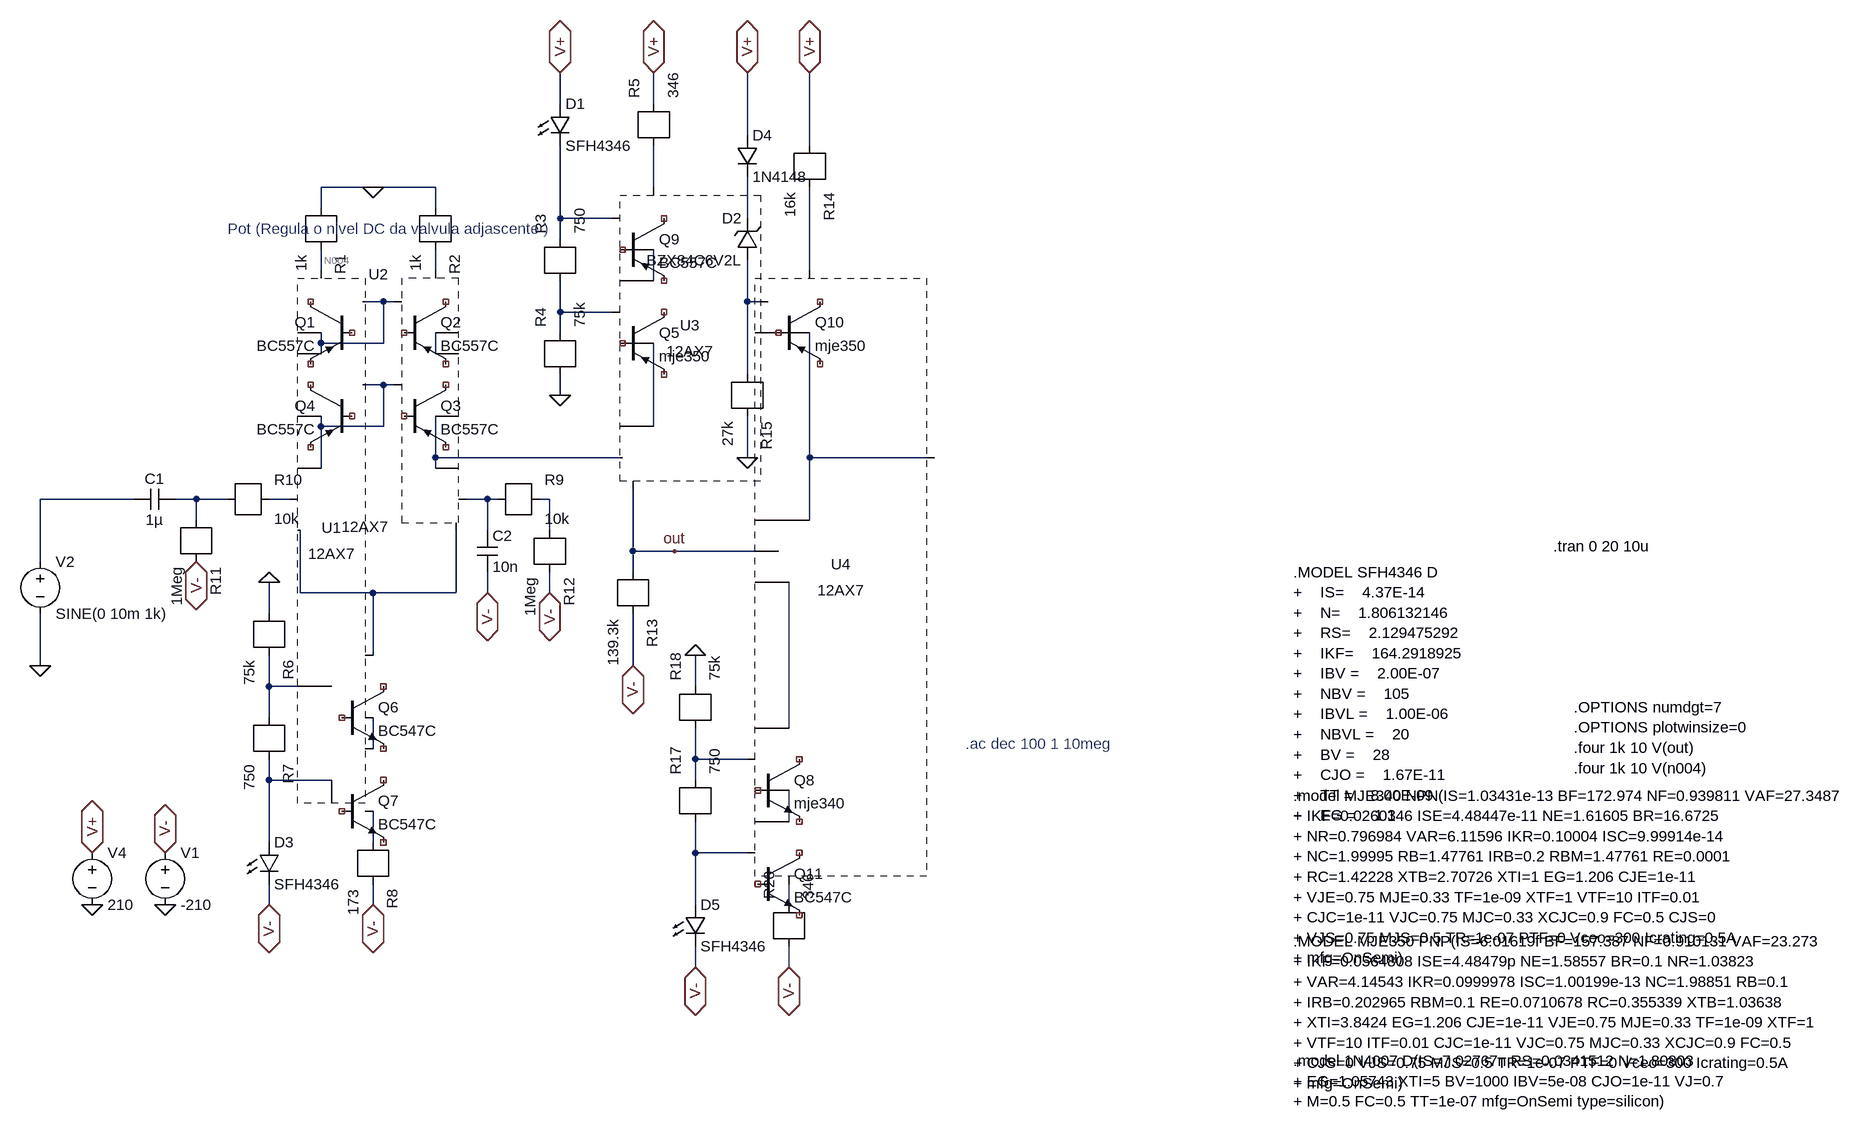
[diagram p0: schematic pre_TCC_active_loads.asc]
pre_TCC_active_loads.asc, the LTspice schematic file:
Version 4
SHEET 1 4724 1424
WIRE 640 -288 640 -336
WIRE 784 -288 784 -336
WIRE 928 -240 928 -336
WIRE 1024 -224 1024 -336
WIRE 352 -160 272 -160
WIRE 448 -160 352 -160
WIRE 784 -160 784 -224
WIRE 272 -128 272 -160
WIRE 448 -128 448 -160
WIRE 640 -112 640 -224
WIRE 720 -112 640 -112
WIRE 928 -112 928 -176
WIRE 640 -80 640 -112
WIRE 272 -32 272 -64
WIRE 448 -32 448 -64
WIRE 1024 -32 1024 -160
WIRE 784 -16 784 -64
WIRE 368 16 336 16
WIRE 384 16 368 16
WIRE 928 16 928 -48
WIRE 960 16 928 16
WIRE 640 32 640 -16
WIRE 720 32 640 32
WIRE 640 64 640 32
WIRE 272 80 272 64
WIRE 368 80 368 16
WIRE 368 80 272 80
WIRE 272 96 272 80
WIRE 448 96 448 64
WIRE 928 128 928 16
WIRE 368 144 336 144
WIRE 384 144 368 144
WIRE 640 160 640 128
WIRE 272 208 272 192
WIRE 368 208 368 144
WIRE 368 208 272 208
WIRE 784 208 784 80
WIRE 448 256 448 192
WIRE 736 256 448 256
WIRE 928 256 928 192
WIRE 1024 256 1024 64
WIRE 1216 256 1024 256
WIRE 272 272 272 208
WIRE 448 272 448 256
WIRE -16 320 -160 320
WIRE 80 320 48 320
WIRE 128 320 80 320
WIRE 224 320 192 320
WIRE 528 320 496 320
WIRE 544 320 528 320
WIRE 624 320 608 320
WIRE 80 352 80 320
WIRE 1024 352 1024 256
WIRE 528 368 528 320
WIRE 624 368 624 320
WIRE 752 400 752 304
WIRE 816 400 752 400
WIRE 976 400 816 400
WIRE -160 416 -160 320
WIRE 752 432 752 400
WIRE 240 464 240 368
WIRE 352 464 240 464
WIRE 480 464 480 368
WIRE 480 464 352 464
WIRE 528 464 528 432
WIRE 624 464 624 432
WIRE 192 496 192 448
WIRE 352 560 352 464
WIRE -160 576 -160 496
WIRE 752 576 752 496
WIRE 192 608 192 560
WIRE 288 608 192 608
WIRE 848 608 848 560
WIRE 192 656 192 608
WIRE 992 672 992 448
WIRE 352 704 352 656
WIRE 848 720 848 672
WIRE 928 720 848 720
WIRE 192 752 192 720
WIRE 288 752 192 752
WIRE 848 752 848 720
WIRE 992 816 992 768
WIRE 192 848 192 752
WIRE 352 848 352 800
WIRE 848 864 848 816
WIRE 928 864 848 864
WIRE 192 944 192 912
WIRE 352 944 352 912
WIRE 848 944 848 864
WIRE 992 944 992 912
WIRE 848 1040 848 1008
WIRE 992 1040 992 1008
FLAG -160 576 0
FLAG 192 448 0
FLAG -80 864 V+
IOPIN -80 864 BiDir
FLAG 32 864 V-
IOPIN 32 864 BiDir
FLAG 32 944 0
FLAG -80 944 0
FLAG 352 944 V-
IOPIN 352 944 BiDir
FLAG 192 944 V-
IOPIN 192 944 BiDir
FLAG 352 -160 0
FLAG 80 416 V-
IOPIN 80 416 BiDir
FLAG 624 464 V-
IOPIN 624 464 BiDir
FLAG 528 464 V-
IOPIN 528 464 BiDir
FLAG 640 160 0
FLAG 784 -336 V+
IOPIN 784 -336 BiDir
FLAG 640 -336 V+
IOPIN 640 -336 BiDir
FLAG 752 576 V-
IOPIN 752 576 BiDir
FLAG 1024 -336 V+
IOPIN 1024 -336 BiDir
FLAG 816 400 out
FLAG 848 1040 V-
IOPIN 848 1040 BiDir
FLAG 992 1040 V-
IOPIN 992 1040 BiDir
FLAG 848 560 0
FLAG 928 256 0
FLAG 928 -336 V+
IOPIN 928 -336 BiDir
SYMBOL NormanKoren/12AX7 272 320 R0
SYMATTR InstName U1
SYMBOL NormanKoren/12AX7 448 320 M0
SYMATTR InstName U2
SYMBOL pnp 320 16 M0
SYMATTR InstName Q1
SYMATTR Value BC557C
SYMBOL pnp 400 16 R0
SYMATTR InstName Q2
SYMATTR Value BC557C
SYMBOL voltage -160 400 R0
SYMATTR InstName V2
SYMATTR Value SINE(0 10m 1k)
SYMATTR Value2 AC 1
SYMBOL cap 48 304 R90
WINDOW 0 0 32 VBottom 2
WINDOW 3 32 32 VTop 2
SYMATTR InstName C1
SYMATTR Value 1µ
SYMBOL r 272 -128 R90
SYMATTR InstName R1
SYMATTR Value 1k
SYMBOL r 448 -128 R90
SYMATTR InstName R2
SYMATTR Value 1k
SYMBOL pnp 400 144 R0
SYMATTR InstName Q3
SYMATTR Value BC557C
SYMBOL pnp 320 144 M0
SYMATTR InstName Q4
SYMATTR Value BC557C
SYMBOL NormanKoren/12AX7 784 256 R0
SYMATTR InstName U3
SYMBOL voltage -80 848 R0
SYMATTR InstName V4
SYMATTR Value 210
SYMBOL LED 176 848 R0
SYMATTR InstName D3
SYMATTR Value SFH4346
SYMBOL r 192 496 R90
SYMATTR InstName R6
SYMATTR Value 75k
SYMBOL r 192 656 R90
SYMATTR InstName R7
SYMATTR Value 750
SYMBOL r 352 848 R90
SYMATTR InstName R8
SYMATTR Value 173
SYMBOL npn 304 608 R0
SYMATTR InstName Q6
SYMATTR Value BC547C
SYMBOL npn 304 752 R0
SYMATTR InstName Q7
SYMATTR Value BC547C
SYMBOL voltage 32 848 R0
SYMATTR InstName V1
SYMATTR Value -210
SYMBOL r 544 320 R0
SYMATTR InstName R9
SYMATTR Value 10k
SYMBOL r 128 320 R0
SYMATTR InstName R10
SYMATTR Value 10k
SYMBOL r 80 352 R90
SYMATTR InstName R11
SYMATTR Value 1Meg
SYMBOL r 624 368 R90
SYMATTR InstName R12
SYMATTR Value 1Meg
SYMBOL cap 512 368 R0
SYMATTR InstName C2
SYMATTR Value 10n
SYMBOL r 640 -16 R270
SYMATTR InstName R3
SYMATTR Value 750
SYMBOL r 640 128 R270
SYMATTR InstName R4
SYMATTR Value 75k
SYMBOL r 784 -224 R270
SYMATTR InstName R5
SYMATTR Value 346
SYMBOL LED 624 -288 R0
SYMATTR InstName D1
SYMATTR Value SFH4346
SYMBOL pnp 736 -112 R0
SYMATTR InstName Q9
SYMATTR Value BC557C
SYMBOL pnp 736 32 R0
SYMATTR InstName Q5
SYMATTR Value mje350
SYMBOL r 752 432 R90
SYMATTR InstName R13
SYMATTR Value 139.3k
SYMBOL NormanKoren/12AX7 1024 400 R0
SYMATTR InstName U4
SYMBOL r 848 816 R270
SYMATTR InstName R17
SYMATTR Value 750
SYMBOL r 848 672 R270
SYMATTR InstName R18
SYMATTR Value 75k
SYMBOL LED 832 944 R0
SYMATTR InstName D5
SYMATTR Value SFH4346
SYMBOL r 992 1008 R270
SYMATTR InstName R20
SYMATTR Value 346
SYMBOL npn 944 864 R0
SYMATTR InstName Q11
SYMATTR Value BC547C
SYMBOL npn 944 720 R0
SYMATTR InstName Q8
SYMATTR Value mje340
SYMBOL pnp 976 16 R0
SYMATTR InstName Q10
SYMATTR Value mje350
SYMBOL r 1024 -224 R90
SYMATTR InstName R14
SYMATTR Value 16k
SYMBOL zener 944 -48 R180
WINDOW 0 24 64 Left 2
WINDOW 3 24 0 Left 2
SYMATTR InstName D2
SYMATTR Value BZX84C6V2L
SYMBOL diode 912 -240 R0
WINDOW 0 24 0 Left 2
WINDOW 3 24 64 Left 2
SYMATTR InstName D4
SYMATTR Value 1N4148
SYMATTR Description Zener Diode
SYMATTR Type zener
SYMBOL r 928 128 R90
SYMATTR InstName R15
SYMATTR Value 27k
TEXT 2168 392 Left 2 !.tran 0 20 10u
TEXT 2200 640 Left 2 !.OPTIONS numdgt=7\n.OPTIONS plotwinsize=0\n.four 1k 10 V(out)\n.four 1k 10 V(n004)
TEXT 1768 432 Left 2 !.MODEL SFH4346 D	\n+	IS=	4.37E-14\n+	N=	1.806132146\n+	RS=	2.129475292\n+	IKF=	164.2918925\n+	IBV =	2.00E-07\n+	NBV =	105\n+	IBVL =	1.00E-06\n+	NBVL =	20\n+	BV =	28\n+	CJO =	1.67E-11\n+	TT =	8.00E-09\n+	EG =	1.3
TEXT 1264 696 Left 2 ;.ac dec 100 1 10meg
TEXT 128 -96 Left 2 ;Pot (Regula o nivel DC da valvula adjascente )
TEXT 1768 776 Left 2 !.model MJE340 NPN(IS=1.03431e-13 BF=172.974 NF=0.939811 VAF=27.3487\n+ IKF=0.0260146 ISE=4.48447e-11 NE=1.61605 BR=16.6725\n+ NR=0.796984 VAR=6.11596 IKR=0.10004 ISC=9.99914e-14\n+ NC=1.99995 RB=1.47761 IRB=0.2 RBM=1.47761 RE=0.0001\n+ RC=1.42228 XTB=2.70726 XTI=1 EG=1.206 CJE=1e-11\n+ VJE=0.75 MJE=0.33 TF=1e-09 XTF=1 VTF=10 ITF=0.01\n+ CJC=1e-11 VJC=0.75 MJC=0.33 XCJC=0.9 FC=0.5 CJS=0\n+ VJS=0.75 MJS=0.5 TR=1e-07 PTF=0 Vceo=300 Icrating=0.5A\n+ mfg=OnSemi)
TEXT 1768 1000 Left 2 !.MODEL MJE350 PNP(IS=6.01619f BF=157.387 NF=0.910131 VAF=23.273\n+ IKF=0.0564808 ISE=4.48479p NE=1.58557 BR=0.1 NR=1.03823\n+ VAR=4.14543 IKR=0.0999978 ISC=1.00199e-13 NC=1.98851 RB=0.1\n+ IRB=0.202965 RBM=0.1 RE=0.0710678 RC=0.355339 XTB=1.03638\n+ XTI=3.8424 EG=1.206 CJE=1e-11 VJE=0.75 MJE=0.33 TF=1e-09 XTF=1\n+ VTF=10 ITF=0.01 CJC=1e-11 VJC=0.75 MJC=0.33 XCJC=0.9 FC=0.5\n+ CJS=0 VJS=0.75 MJS=0.5 TR=1e-07 PTF=0 Vceo=300 Icrating=0.5A\n+ mfg=OnSemi)
TEXT 1768 1184 Left 2 !.model 1N4007 D(IS=7.02767n RS=0.0341512 N=1.80803 \n+ EG=1.05743 XTI=5 BV=1000 IBV=5e-08 CJO=1e-11 VJ=0.7 \n+ M=0.5 FC=0.5 TT=1e-07 mfg=OnSemi type=silicon)

The netlist it stands for:
* pre_TCC_active_loads.asc
* U1: 12AX7 (symbol NormanKoren/12AX7 not available, pin order unknown); nets seen at it: N004, N008, N012, N018, N021, N022, N024, N026, N028
* U2: 12AX7 (symbol NormanKoren/12AX7 not available, pin order unknown); nets seen at it: N005, N008, N011, N012, N014, N019, N021
Q1 NC_01 NC_02 NC_03 0 BC557C
Q2 NC_04 NC_05 NC_06 0 BC557C
V2 N016 0 SINE(0 10m 1k) AC 1
C1 N017 N016 1µ
R1 N004 0 1k
R2 N005 0 1k
Q3 NC_07 NC_08 NC_09 0 BC557C
Q4 NC_10 NC_11 NC_12 0 BC557C
* U3: 12AX7 (symbol NormanKoren/12AX7 not available, pin order unknown); nets seen at it: N001, N002, N007, N009, N010, N013, N014, out
V4 V+ 0 210
D3 N026 V- SFH4346
R6 N022 0 75k
R7 N026 N022 750
R8 V- N028 173
Q6 NC_13 NC_14 NC_15 0 BC547C
Q7 NC_16 NC_17 NC_18 0 BC547C
V1 V- 0 -210
R9 N020 N019 10k
R10 N018 N017 10k
R11 V- N017 1Meg
R12 V- N020 1Meg
C2 N019 V- 10n
R3 N002 N010 750
R4 N010 0 75k
R5 V+ N001 346
D1 V+ N002 SFH4346
Q9 NC_19 NC_20 NC_21 0 BC557C
Q5 NC_22 NC_23 NC_24 0 mje350
R13 V- out 139.3k
* U4: 12AX7 (symbol NormanKoren/12AX7 not available, pin order unknown); nets seen at it: N006, N015, N023, N025, N027, N029, N030, out
R17 N025 N029 750
R18 0 N025 75k
D5 N029 V- SFH4346
R20 N030 V- 346
Q11 NC_25 NC_26 NC_27 0 BC547C
Q8 NC_28 NC_29 NC_30 0 mje340
Q10 NC_31 NC_32 NC_33 0 mje350
R14 N006 V+ 16k
D2 N009 N003 BZX84C6V2L
D4 V+ N003 1N4148
R15 0 N009 27k
.model D D
.lib standard.dio
.model NPN NPN
.model PNP PNP
.lib standard.bjt
.tran 0 20 10u
.OPTIONS numdgt=7
.OPTIONS plotwinsize=0
.four 1k 10 V(out)
.four 1k 10 V(n004)
.MODEL SFH4346 D
+	IS=	4.37E-14
+	N=	1.806132146
+	RS=	2.129475292
+	IKF=	164.2918925
+	IBV =	2.00E-07
+	NBV =	105
+	IBVL =	1.00E-06
+	NBVL =	20
+	BV =	28
+	CJO =	1.67E-11
+	TT =	8.00E-09
+	EG =	1.3
* .ac dec 100 1 10meg
* Pot (Regula o nivel DC da valvula adjascente )
.model MJE340 NPN(IS=1.03431e-13 BF=172.974 NF=0.939811 VAF=27.3487
+ IKF=0.0260146 ISE=4.48447e-11 NE=1.61605 BR=16.6725
+ NR=0.796984 VAR=6.11596 IKR=0.10004 ISC=9.99914e-14
+ NC=1.99995 RB=1.47761 IRB=0.2 RBM=1.47761 RE=0.0001
+ RC=1.42228 XTB=2.70726 XTI=1 EG=1.206 CJE=1e-11
+ VJE=0.75 MJE=0.33 TF=1e-09 XTF=1 VTF=10 ITF=0.01
+ CJC=1e-11 VJC=0.75 MJC=0.33 XCJC=0.9 FC=0.5 CJS=0
+ VJS=0.75 MJS=0.5 TR=1e-07 PTF=0 Vceo=300 Icrating=0.5A
+ mfg=OnSemi)
.MODEL MJE350 PNP(IS=6.01619f BF=157.387 NF=0.910131 VAF=23.273
+ IKF=0.0564808 ISE=4.48479p NE=1.58557 BR=0.1 NR=1.03823
+ VAR=4.14543 IKR=0.0999978 ISC=1.00199e-13 NC=1.98851 RB=0.1
+ IRB=0.202965 RBM=0.1 RE=0.0710678 RC=0.355339 XTB=1.03638
+ XTI=3.8424 EG=1.206 CJE=1e-11 VJE=0.75 MJE=0.33 TF=1e-09 XTF=1
+ VTF=10 ITF=0.01 CJC=1e-11 VJC=0.75 MJC=0.33 XCJC=0.9 FC=0.5
+ CJS=0 VJS=0.75 MJS=0.5 TR=1e-07 PTF=0 Vceo=300 Icrating=0.5A
+ mfg=OnSemi)
.model 1N4007 D(IS=7.02767n RS=0.0341512 N=1.80803
+ EG=1.05743 XTI=5 BV=1000 IBV=5e-08 CJO=1e-11 VJ=0.7
+ M=0.5 FC=0.5 TT=1e-07 mfg=OnSemi type=silicon)
.backanno
.end